# EAGLE design untitled (EAGLE 6.1)
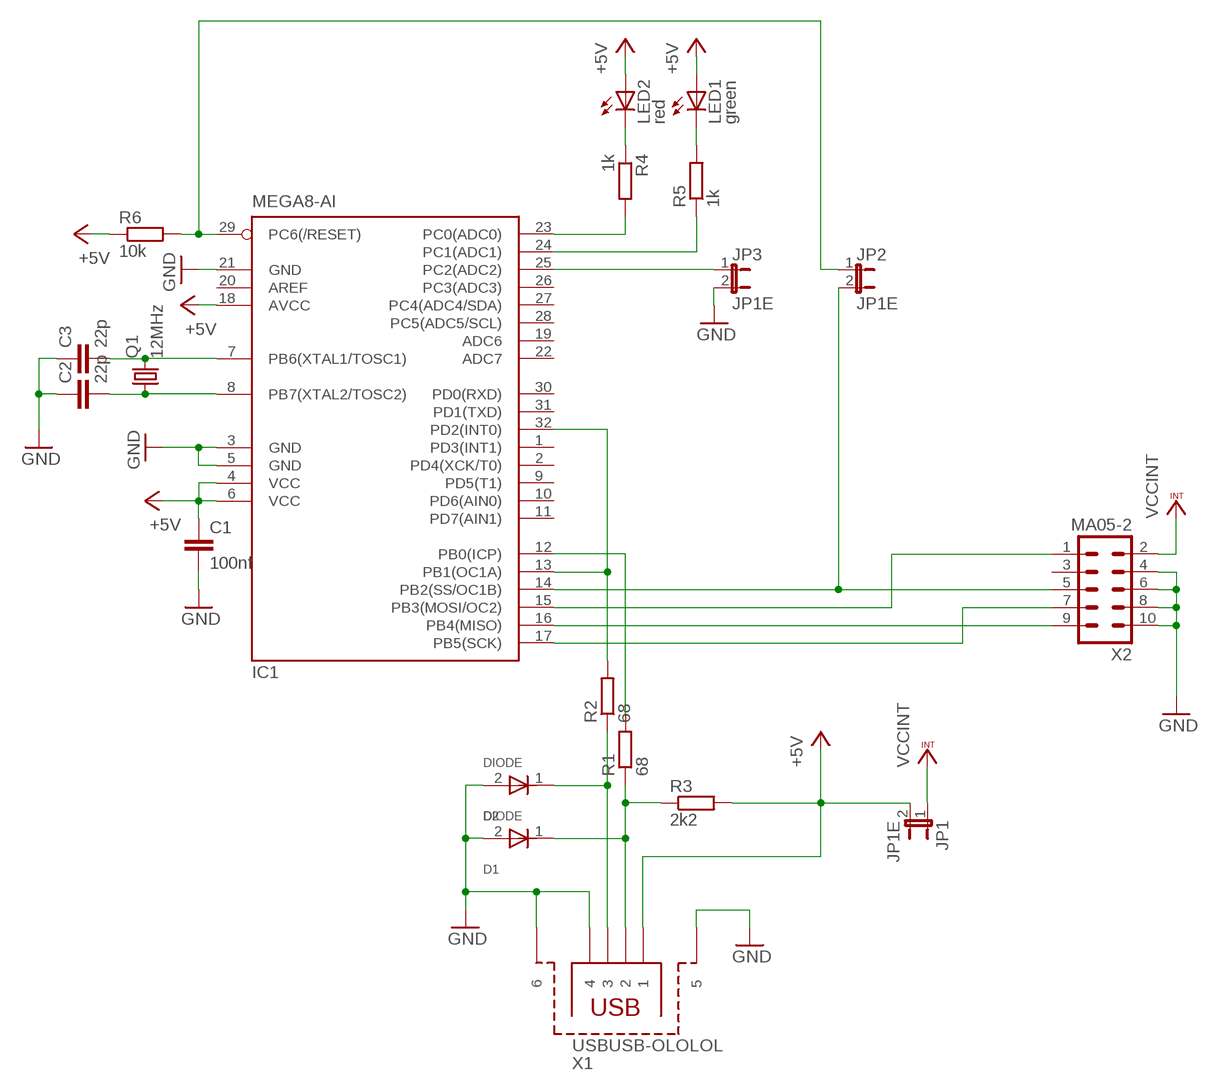
[diagram p0: schematic, sheet 1]

## Parts
C1  100nf  C-EUC0805  [C0805]
C2  22p  C-EUC0805  [C0805]
C3  22p  C-EUC0805  [C0805]
D1  DIODE  [SOD80]
D2  DIODE  [SOD80]
IC1  MEGA8-AI  [TQFP32-08]
JP1  JP1E  [JP0603]
JP2  JP1E  [JP0603]
JP3  JP1E  [JP0603]
LED1  green  LEDCHIPLED_0805  [CHIPLED_0805]
LED2  red  LEDCHIPLED_0805  [CHIPLED_0805]
Q1  12MHz  CRYSTALHC49S  [HC49/S]
R1  68  R-EU_R0603  [R0603]
R2  68  R-EU_R0603  [R0603]
R3  2k2  R-EU_R0603  [R0603]
R4  1k  R-EU_R0603  [R0603]
R5  1k  R-EU_R0603  [R0603]
R6  10k  R-EU_R0603  [R0603]
X1  USBUSB-OLOLOL  [USB]
X2  MA05-2  [MA05-2]

## Nets
+5V: C1.1 IC1.4(VCC) IC1.6(VCC) IC1.18(AVCC) JP1.2 LED1.A LED2.A R3.2 R6.1 X1.1
GND: C1.2 C2.1 C3.1 D1.2(ANOD) D2.2(ANOD) IC1.3(GND) IC1.5(GND) IC1.21(GND) JP3.2 X1.4 X1.5 X1.6 X2.4 X2.6 X2.8 X2.10
N$1: IC1.23(PC0(ADC0)) R4.2
N$2: LED2.C R4.1
N$3: LED1.C R5.2
N$4: IC1.24(PC1(ADC1)) R5.1
N$5: IC1.25(PC2(ADC2)) JP3.1
N$6: IC1.29(PC6(/RESET)) JP2.1 R6.2
N$7: C2.2 IC1.8(PB7(XTAL2/TOSC2)) Q1.1
N$8: IC1.14(PB2(SS/OC1B)) JP2.2 X2.5
N$9: IC1.15(PB3(MOSI/OC2)) X2.1
N$10: IC1.17(PB5(SCK)) X2.7
N$11: IC1.16(PB4(MISO)) X2.9
N$12: C3.2 IC1.7(PB6(XTAL1/TOSC1)) Q1.2
N$13: D1.1(KATOD) R1.1 R3.1 X1.2
N$14: D2.1(KATOD) R2.1 X1.3
N$15: IC1.13(PB1(OC1A)) IC1.32(PD2(INT0)) R2.2
N$16: IC1.12(PB0(ICP)) R1.2
VCCINT: JP1.1 X2.2
Unconnected: IC1.1(PD3(INT1)) IC1.2(PD4(XCK/T0)) IC1.9(PD5(T1)) IC1.10(PD6(AIN0)) IC1.11(PD7(AIN1)) IC1.19(ADC6) IC1.20(AREF) IC1.22(ADC7) IC1.26(PC3(ADC3)) IC1.27(PC4(ADC4/SDA)) IC1.28(PC5(ADC5/SCL)) IC1.30(PD0(RXD)) IC1.31(PD1(TXD)) X2.3

## Library data of the parts
C1-C3 = rcl:C-EU: CAPACITOR, European symbol
D1 D2 = usb:DIODE: DIODE
IC1 = atmel:MEGA8: MICROCONTROLLER 8 Kbytes FLASH, 1 kbytes SRAM, 512 bytes EEPROM, USART, 6-channel 10 bit ADC, 2-channel 8 bit ADC Pin compatible with Atmega48, ATMega88, ATMega168 Source: avr.lbr; MPN: ATMEGA8-16AU; OC_FARNELL: 9171371; OC_NEWARK: 73M8863
JP1-JP3 = usb:JP1E: JUMPER SMD0603
LED1 LED2 = led:LED: LED OSRAM: - CHIPLED LG R971, LG N971, LY N971, LG Q971, LY Q971, LO R971, LY R971 LH N974, LH R974 LS Q976, LO Q976, LY Q976 LO Q996 - Hyper CHIPLED LW Q18S LB Q993, LB Q99A, LB R99A - SideLED LS A670, LO A670, LY A670, LG A670, LP A670 LB A673, LV A673, LT A673, LW A673 LH A674 LY A675 LS A676, LA A676, LO A676, LY A676, LW A676 LS A679, LY A679, LG A679 - Hyper Micro SIDELED® LS Y876, LA Y876, LO Y876, LY Y876 LT Y87S - SmartLED LW L88C, LW L88S LB L89C, LB L89S, LG L890 LS L89K, LO L89K, LY L89K LS L896, LA L896, LO L896, LY L896 - TOPLED LS T670, LO T670, LY T670, LG T670, LP T670 LSG T670, LSP T670, LSY T670, LOP T670, LYG T670 LG T671, LOG T671, LSG T671 LB T673, LV T673, LT T673, LW T673 LH T674 LS T676, LA T676, LO T676, LY T676, LB T676, LH T676, LSB T676, LW T676 LB T67C, LV T67C, LT T67C, LS T67K, LO T67K, LY T67K, LW E67C LS E67B, LA E67B, LO E67B, LY E67B, LB E67C, LV E67C, LT E67C LW T67C LS T679, LY T679, LG T679 LS T770, LO T770, LY T770, LG T770, LP T770 LB T773, LV T773, LT T773, LW T773 LH T774 LS E675, LA E675, LY E675, LS T675 LS T776, LA T776, LO T776, LY T776, LB T776 LHGB T686 LT T68C, LB T68C - Hyper Mini TOPLED® LB M676 - Mini TOPLED Santana® LG M470 LS M47K, LO M47K, LY M47K Source: http://www.osram.convergy.de LUXEON: - LUMILED® LXK2-PW12-R00, LXK2-PW12-S00, LXK2-PW14-U00, LXK2-PW14-V00 LXK2-PM12-R00, LXK2-PM12-S00, LXK2-PM14-U00 LXK2-PE12-Q00, LXK2-PE12-R00, LXK2-PE12-S00, LXK2-PE14-T00, LXK2-PE14-U00 LXK2-PB12-K00, LXK2-PB12-L00, LXK2-PB12-M00, LXK2-PB14-N00, LXK2-PB14-P00, LXK2-PB14-Q00 LXK2-PR12-L00, LXK2-PR12-M00, LXK2-PR14-Q00, LXK2-PR14-R00 LXK2-PD12-Q00, LXK2-PD12-R00, LXK2-PD12-S00 LXK2-PH12-R00, LXK2-PH12-S00 LXK2-PL12-P00, LXK2-PL12-Q00, LXK2-PL12-R00 Source: www.luxeon.com KINGBRIGHT: KA-3528ASYC Source: www.kingbright.com
Q1 = crystal:CRYSTAL: CRYSTAL; OC_FARNELL: 1667008; OC_NEWARK: unknown
R1-R6 = rcl:R-EU_: RESISTOR, European symbol
X1 = usb:USB: USB Port
X2 = usb:MA05-2: PIN HEADER; OC_FARNELL: unknown; OC_NEWARK: unknown

## Board
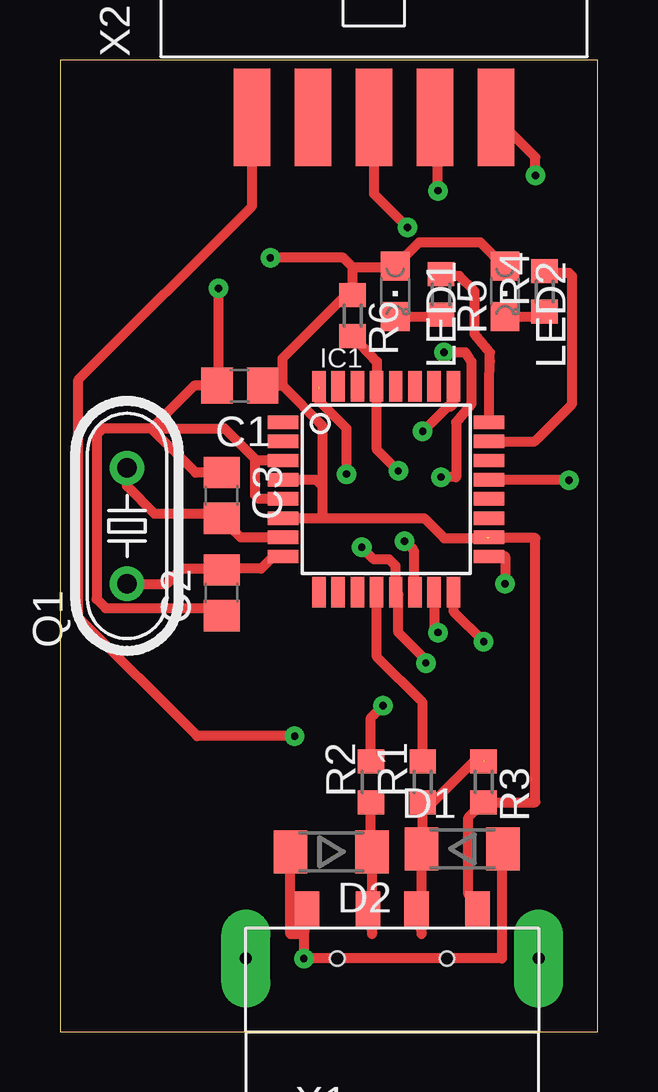
[diagram p1: board, top side]
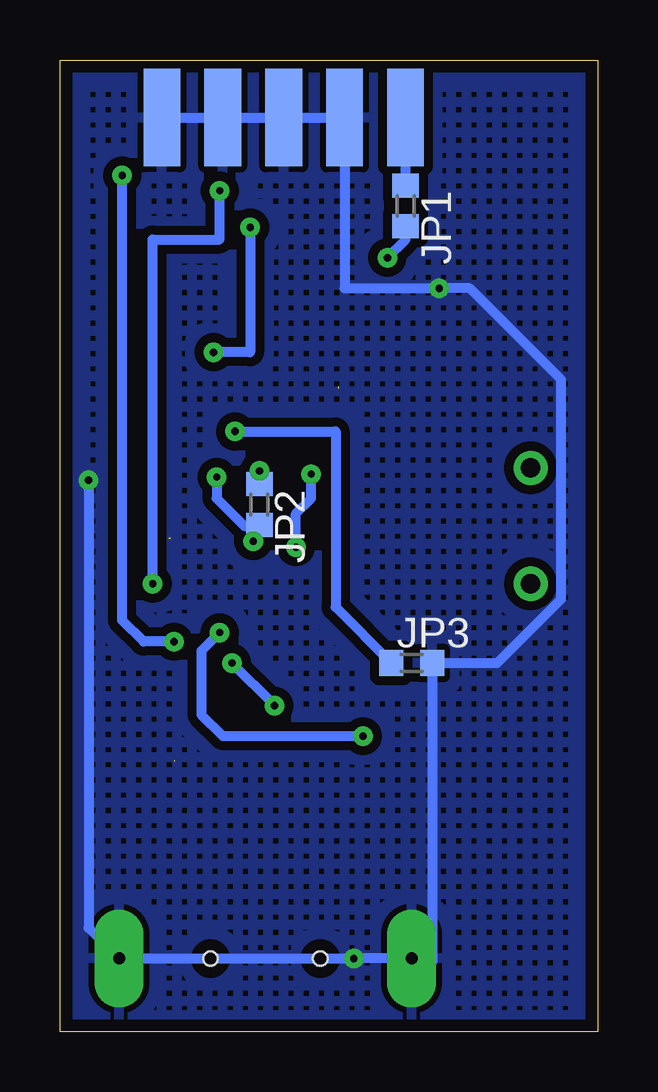
[diagram p2: board, bottom side, seen from below]

Size 22.4 x 40.5 mm. Coordinates in mm from the lower left corner, seen from the top.
Outline: 0,0 22.4,0 22.4,40.5 0,40.5 0,0
Copper layers (1*16): Top 0.035mm / dielectric 1.5mm / Bottom 0.035mm
Design rules "default": minimum track width 12mil, minimum drill 20mil, track to track 12mil, track to pad 12mil, pad to pad 12mil, via to via 12mil, smd to smd 8mil, copper to edge 20mil, drill to drill 40mil, minimum pad ring 12mil, minimum via ring 10mil, stop-mask expansion 4mil, vias tented up to drill 0mil, thermal gap 10mil

### Footprints (pad centres in the part's own frame; a part is rotated, then mirrored left to right if it is on the bottom)
C0805 = smd 1.3 x 1.5: 1 -0.95,0; 2 0.95,0
SOD80 = smd 1.4 x 1.8: 1 -1.7,0; 2 1.7,0
TQFP32-08 = smd 1.27 x 0.559: 1 -4.293,2.8; 2 -4.293,2; 3 -4.293,1.2; 4 -4.293,0.4; 5 -4.293,-0.4; 6 -4.293,-1.2; 7 -4.293,-2; 8 -4.293,-2.8; 17 4.293,-2.8; 18 4.293,-2; 19 4.293,-1.2; 20 4.293,-0.4; 21 4.293,0.4; 22 4.293,1.2; 23 4.293,2; 24 4.293,2.8 | smd 0.559 x 1.27: 9 -2.8,-4.293; 10 -2,-4.293; 11 -1.2,-4.293; 12 -0.4,-4.293; 13 0.4,-4.293; 14 1.2,-4.293; 15 2,-4.293; 16 2.8,-4.293; 25 2.8,4.293; 26 2,4.293; 27 1.2,4.293; 28 0.4,4.293; 29 -0.4,4.293; 30 -1.2,4.293; 31 -2,4.293; 32 -2.8,4.293
JP0603 = smd 1 x 1.1: 1 -0.85,0; 2 0.85,0
CHIPLED_0805 = smd 1.2 x 1.2: A 0,-1.05; C 0,1.05
HC49/S = drill 0.813: 1 -2.413,0; 2 2.413,0
R0603 = smd 1 x 1.1: 1 -0.85,0; 2 0.85,0
USB = smd 1.016 x 1.524: 1 3.556,5.08; 2 1.016,5.08; 3 -1.016,5.08; 4 -3.556,5.08 | drill 0.5 pad 2.032 long: 5 6.096,3.048; 6 -6.096,3.048 | hole 0.6: -2.286,3.048; 2.286,3.048
MA05-2 = smd 4.064 x 1.524: 1 0,5.08; 3 0,2.54; 5 0,0; 7 0,-2.54; 9 0,-5.08 | smd 4.064 x 1.524 bottom: 2 0,5.08; 4 0,2.54; 6 0,0; 8 0,-2.54; 10 0,-5.08

### Placement (x,y rotation side)
C1  7.49,26.92 180 top
C2  6.73,18.29 90 top
C3  6.73,22.35 270 top
D1  16.76,7.62 0 top
D2  11.3,7.49 180 top
IC1  13.59,22.61 0 top
JP1  8,34.42 270 bottom
JP2  14.1,21.97 270 bottom
JP3  7.75,15.37 0 bottom
LED1  13.97,30.86 180 top
LED2  18.54,30.86 180 top
Q1  2.79,21.08 90 top
R1  15.11,10.41 90 top
R2  12.95,10.41 90 top
R3  17.65,10.41 270 top
R4  20.19,30.86 90 top
R5  15.88,30.73 270 top
R6  12.19,29.84 270 top
X1  13.84,0 0 top
X2  13.08,38.1 90 top

### Tracks (layer width: path | path; a pad name or v marks a point on that pad's centre or on a via)
+5V  (via drill 0.3)  (1 unrouted)
  Top 0.406: X1.1 17.4,5.33 17.02,5.71 17.02,8.93 R3.2 19.81,9.56 19.81,20.57 17.88,20.57 IC1.18 | LED2.A 18.03,32.38 17.53,32.89 14.95,32.89 LED1.A 13.94,31.88 12.19,31.88 | IC1.6 10.92,21.41 | 10.92,21.41 15.17,21.41 16,20.57 17.78,20.57 | IC1.4 10.65,23.01 10.92,22.73 | 10.92,22.73 10.92,21.41 | C1.1 9.27,26.92 | 9.27,26.92 10.92,25.27 10.92,22.73 | 9.27,26.92 9.27,28.07 11.94,30.73 12.15,30.73 R6.1 12.19,31.88 | 12.19,31.88 11.81,32.26 v8.76,32.26
  Bottom 0.406: v8.76,32.26 8,33.02 JP1.2
GND  (via drill 0.3)
  Top 0.406: X1.4 10.16,4.06 | 10.16,4.06 v10.16,3.05 18.41,3.05 18.41,7.62 D1.2 | 10.16,4.06 9.6,4.06 D2.2 | 3.81,25.15 1.78,25.15 1.52,24.89 1.52,18.03 1.91,17.65 6.42,17.65 C2.1 | 3.81,25.15 5.59,26.92 C1.2 6.6,26.98 v6.6,30.99 | IC1.3 8.2,23.81 | 8.2,23.81 6.86,25.15 3.81,25.15 | C3.1 5.65,23.3 3.81,25.15 | IC1.5 8.27,22.21 8.13,22.35 8.13,23.74 8.2,23.81 | IC1.21 21.21,23.01 v21.21,22.99
  Bottom 0.406: X1.5 19.94,1.91 | X2.10 X2.8 X2.6 X2.4 10.54,30.99 v6.6,30.99 5.33,30.99 1.52,27.18 1.52,18.03 4.19,15.37 JP3.2 6.9,2.88 X1.6 v10.16,3.05 X1.5 | v21.21,22.99 21.21,4.32 X1.5
  pour Bottom (isolate 0.381, hatched): 0,40.39 22.48,40.39 22.35,0.13 0.13,0.13
N$1
  Top 0.406: IC1.23 19.78,24.61 21.34,26.16 21.34,31.5 21.21,31.62 20.28,31.62 R4.2
N$2
  Top 0.406: LED2.C 19.99,29.81 R4.1
N$3
  Top 0.406: LED1.C 15.8,29.81 R5.2
N$4
  Top 0.406: IC1.24 17.88,27.03 17.91,27.94 17.91,28.32 17.27,29.08 17.27,30.86 16.64,31.5 15.96,31.5 R5.1
N$5  (via drill 0.3)
  Top 0.406: IC1.25 16.39,26.17 16.26,26.04 16.13,26.04 v15.11,25.02
  Bottom 0.406: v15.11,25.02 10.92,25.02 10.92,17.69 JP3.1
N$6  (via drill 0.3)
  Top 0.406: R6.2 13.21,27.94 13.21,26.92 | v14.1,23.37 13.21,24.26 13.21,26.92 | 13.21,26.92 IC1.29
  Bottom 0.406: JP2.1 v14.1,23.37
N$7
  Top 0.406: Q1.1 4.44,18.67 5.08,19.3 6.67,19.3 C2.2 6.8,19.3 8.38,19.3 8.88,19.81 IC1.8
N$8  (via drill 0.3)
  Top 0.406: v14.35,20.45 14.73,20.07 14.73,18.37 IC1.14 | X2.5 13.08,34.92 v14.48,33.53 | v16,28.32 16.89,28.32 17.14,27.94 17.14,26.16 16.51,25.4 16.51,23.11 v15.88,23.11
  Bottom 0.406: v14.35,20.45 JP2.2 14.14,21.08 14.73,21.08 15.88,22.23 v15.88,23.11 | v14.48,33.53 14.48,28.32 v16,28.32
N$9  (via drill 0.3)
  Top 0.406: IC1.15 15.59,16.8 v15.75,16.64 | v9.78,12.32 5.72,12.32 0.76,17.27 0.76,27.18 8,34.42 X2.1
  Bottom 0.406: v15.75,16.64 16.51,15.88 16.51,13.21 15.62,12.32 v9.78,12.32
N$10  (via drill 0.3)
  Top 0.406: IC1.17 18.54,19.81 v18.54,18.67 | v15.75,35.05 15.75,37.34 15.62,37.34 X2.7
  Bottom 0.406: v18.54,18.67 18.54,33.02 15.75,33.02 v15.75,35.05
N$11  (via drill 0.3)
  Top 0.406: IC1.16 16.39,17.52 v17.65,16.26 | v19.81,35.69 19.81,36.45 X2.9
  Bottom 0.406: v17.65,16.26 18.92,16.26 19.81,17.14 v19.81,35.69
N$12
  Top 0.406: IC1.7 7.53,20.61 C3.2 6.54,21.59 3.94,21.59 2.79,22.73 Q1.2
N$13  (1 unrouted)
  Top 0.406: X1.2 15.06,4.06 D1.1 15.11,7.62 R1.1 15.53,9.56 17.4,11.43 17.53,11.43 17.65,11.3
N$14
  Top 0.406: X1.3 13,4.06 D2.1 12.95,7.49 R2.1
N$15  (via drill 0.3)  (1 unrouted)
  Top 0.406: R2.2 12.95,13.08 v13.46,13.59 | v15.24,15.37 15.24,15.49 14.1,16.64 14.1,18.21 IC1.13 13.99,19.41 13.72,19.69 13.08,19.69 v12.57,20.19 | v11.94,23.24 11.94,25.15 10.8,26.29 10.8,26.8
  Bottom 0.406: v13.46,13.59 v15.24,15.37 | v12.57,20.19 12.57,21.59 11.94,22.23 v11.94,23.24
N$16
  Top 0.406: R1.2 15.11,13.72 13.21,15.62 13.21,18.29 IC1.12
VCCINT
  Bottom 0.406: JP1.1 X2.2